# EAGLE design beast_navi_small_ic_curved_repro (EAGLE 9.6.2)
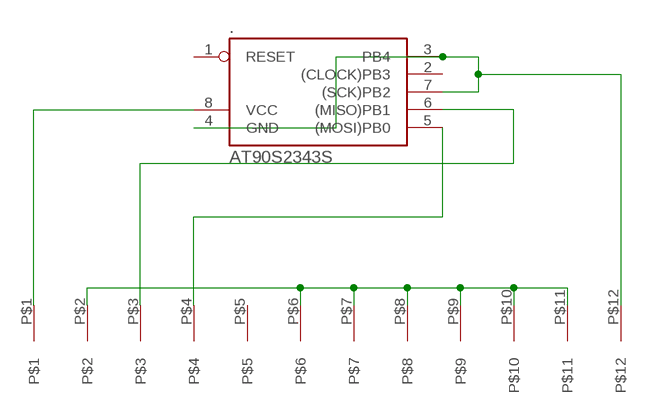
[diagram p0: schematic, sheet 1]

## Parts
.  AT90S2343S  [SOIC8]
U$1  BEAST  [BEAST]

## Nets
N$1: U$1.P$2 U$1.P$6 U$1.P$7 U$1.P$8 U$1.P$9 U$1.P$10 U$1.P$11
N$2: ..3(PB4) ..4(GND) ..7((SCK)PB2) U$1.P$12
N$4: ..8(VCC) U$1.P$1
N$5: ..6((MISO)PB1) U$1.P$3
N$15: ..5((MOSI)PB0) U$1.P$4
Unconnected: ..1(RESET) ..2((CLOCK)PB3) U$1.P$5

## Library data of the parts
. = atmel:AT90*2343: MICROCONTROLLER 2 Kbytes FLASH 128 bytes SRAM 128 bytes EEPROM; OC_FARNELL: unknown; OC_NEWARK: unknown
U$1 = beastpins:BEAST

## Board
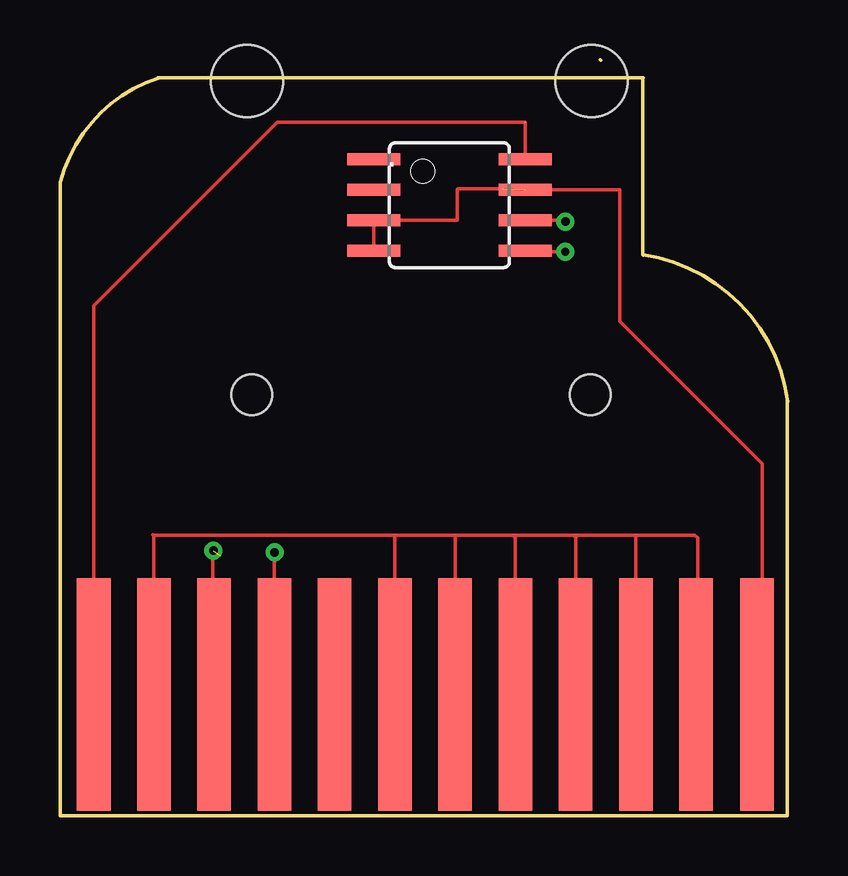
[diagram p1: board, top side]
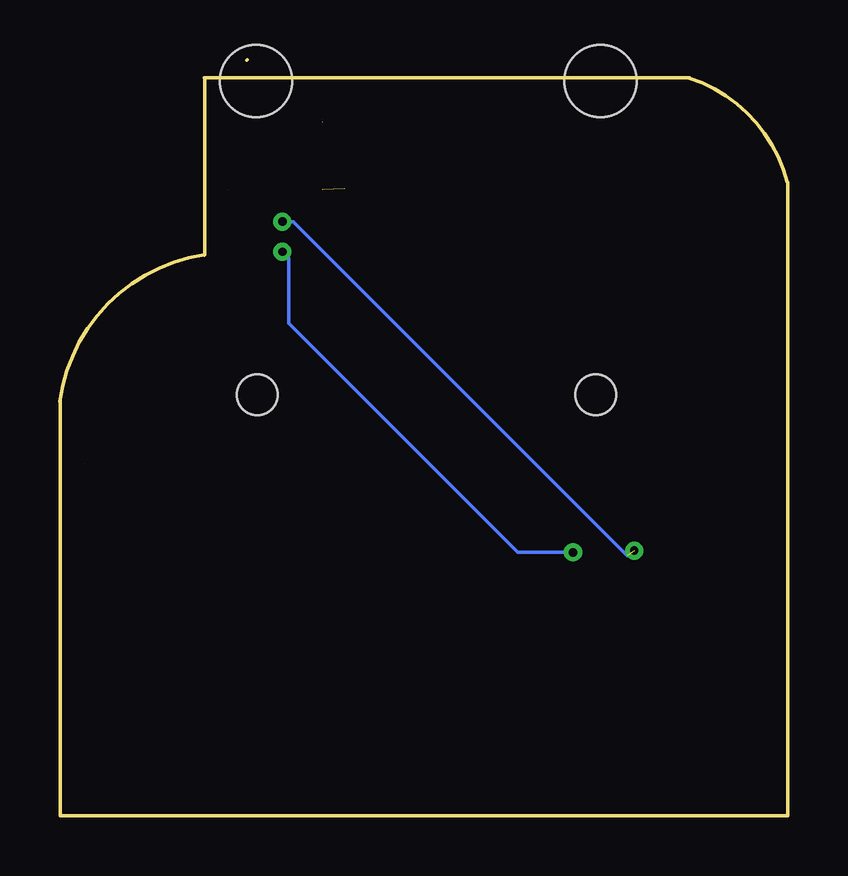
[diagram p2: board, bottom side, seen from below]

Size 30.32 x 31.49 mm. Coordinates in mm from the lower left corner, seen from the top.
Outline: 0,23.45 0,0 30.3,0 30.3,17.25
Outline: 22.54,31.49 22.52,31.49
Outline: 24.29,30.75 24.29,23.37 24.31,23.35
Outline: 24.3,23.37 arc-74 30.32,17.26
Outline: 24.3,30.75 4.07,30.75
Outline: 0,23.43 0,26.4 0.02,26.42
Outline: 0.02,26.4 arc-57 4.09,30.73
Copper layers (1*16): Top 0.035mm / dielectric 1.5mm / Bottom 0.035mm
Design rules "default *": minimum track width 6mil, minimum drill 0.35mm, track to track 1mil, track to pad 6mil, pad to pad 6mil, via to via 6mil, smd to smd 6mil, copper to edge 0.002540625mm, drill to drill 1mil, minimum pad ring 10mil, minimum via ring 8mil, stop-mask expansion 4mil, vias tented up to drill 0mil, thermal gap 10mil
Holes 1.7 mm at 7.99,17.54 22.09,17.54
Holes 3 mm at 22.14,30.62 7.79,30.62

### Footprints (pad centres in the part's own frame; a part is rotated, then mirrored left to right if it is on the bottom)
SOIC8 = smd 0.5 x 2.2: 1 -1.905,-3.154; 2 -0.645,-3.154; 3 0.625,-3.154; 4 1.895,-3.154; 5 1.905,3.154; 6 0.635,3.154; 7 -0.635,3.154; 8 -1.905,3.154
BEAST = smd 1.4 x 9.7: P$1 -27.61,5.02; P$2 -25.1,5.02; P$3 -22.59,5.02; P$4 -20.08,5.02; P$5 -17.57,5.02; P$6 -15.06,5.02; P$7 -12.55,5.02; P$8 -10.04,5.02; P$9 -7.53,5.02; P$10 -5.02,5.02; P$11 -2.51,5.02; P$12 0.03,5.02

### Placement (x,y rotation side)
.  16.23,25.44 270 top
U$1  29.02,0.03 0 top

### Tracks (layer width: path | path; a pad name or v marks a point on that pad's centre or on a via)
N$1
  Top 0.152: 26.57,9.53 26.57,9.16 | U$1.P$11 26.51,9.47 26.57,9.53 | 3.89,11.69 3.92,11.66 U$1.P$2 | 3.85,11.72 3.89,11.69 | 3.89,11.69 13.88,11.69 | 13.88,11.69 16.46,11.69 | 16.46,11.69 18.87,11.69 | 18.87,11.69 21.38,11.69 | 21.38,11.69 23.92,11.69 | 23.92,11.69 26.45,11.69 26.57,11.57 26.57,9.53 | U$1.P$6 13.96,11.61 13.88,11.69 | U$1.P$7 16.46,11.69 | U$1.P$8 18.98,11.58 18.87,11.69 | U$1.P$9 21.49,11.58 21.38,11.69 | U$1.P$10 24,11.61 23.92,11.69
N$2  (3 unrouted)
  Top 0.152: ..4 ..3 | ..3 13.24,24.98 | 29.27,14.66 23.32,20.61 23.32,26.08 | 29.14,5.06 29.14,6.47 28.51,7.1 28.51,7.52 28.65,7.67 28.88,7.67 29.26,8.06 29.26,14.66 | 29.14,5.06 29.14,4.53 | ..3 16.55,24.82 16.55,26.1 16.58,26.12 18.45,26.12 | U$1.P$12 29.1,5.06 29.14,5.06 | ..7 23.32,26.07
N$4  (1 unrouted)
  Top 0.152: U$1.P$1 1.41,21.25 9.05,28.89 19.36,28.89 19.37,28.9 | 19.38,28.89 ..8
N$5  (via drill 0.35)  (1 unrouted)
  Top 0.152: v6.39,11.05 6.36,11.02 6.36,5.11 U$1.P$3 | ..6 21,24.8 v21.05,24.75
  Bottom 0.152: v21.05,24.75 20.61,24.75 6.68,10.83
N$15  (via drill 0.35)
  Top 0.152: v8.94,10.97 U$1.P$4 | 19.44,23.49 ..5 19.52,23.54 19.55,23.5 v21.05,23.5
  Bottom 0.152: v8.94,10.97 11.24,10.97 20.78,20.51 20.78,23.23 v21.05,23.5